# EAGLE board Keyboard (EAGLE 6.3), part 1 of 2
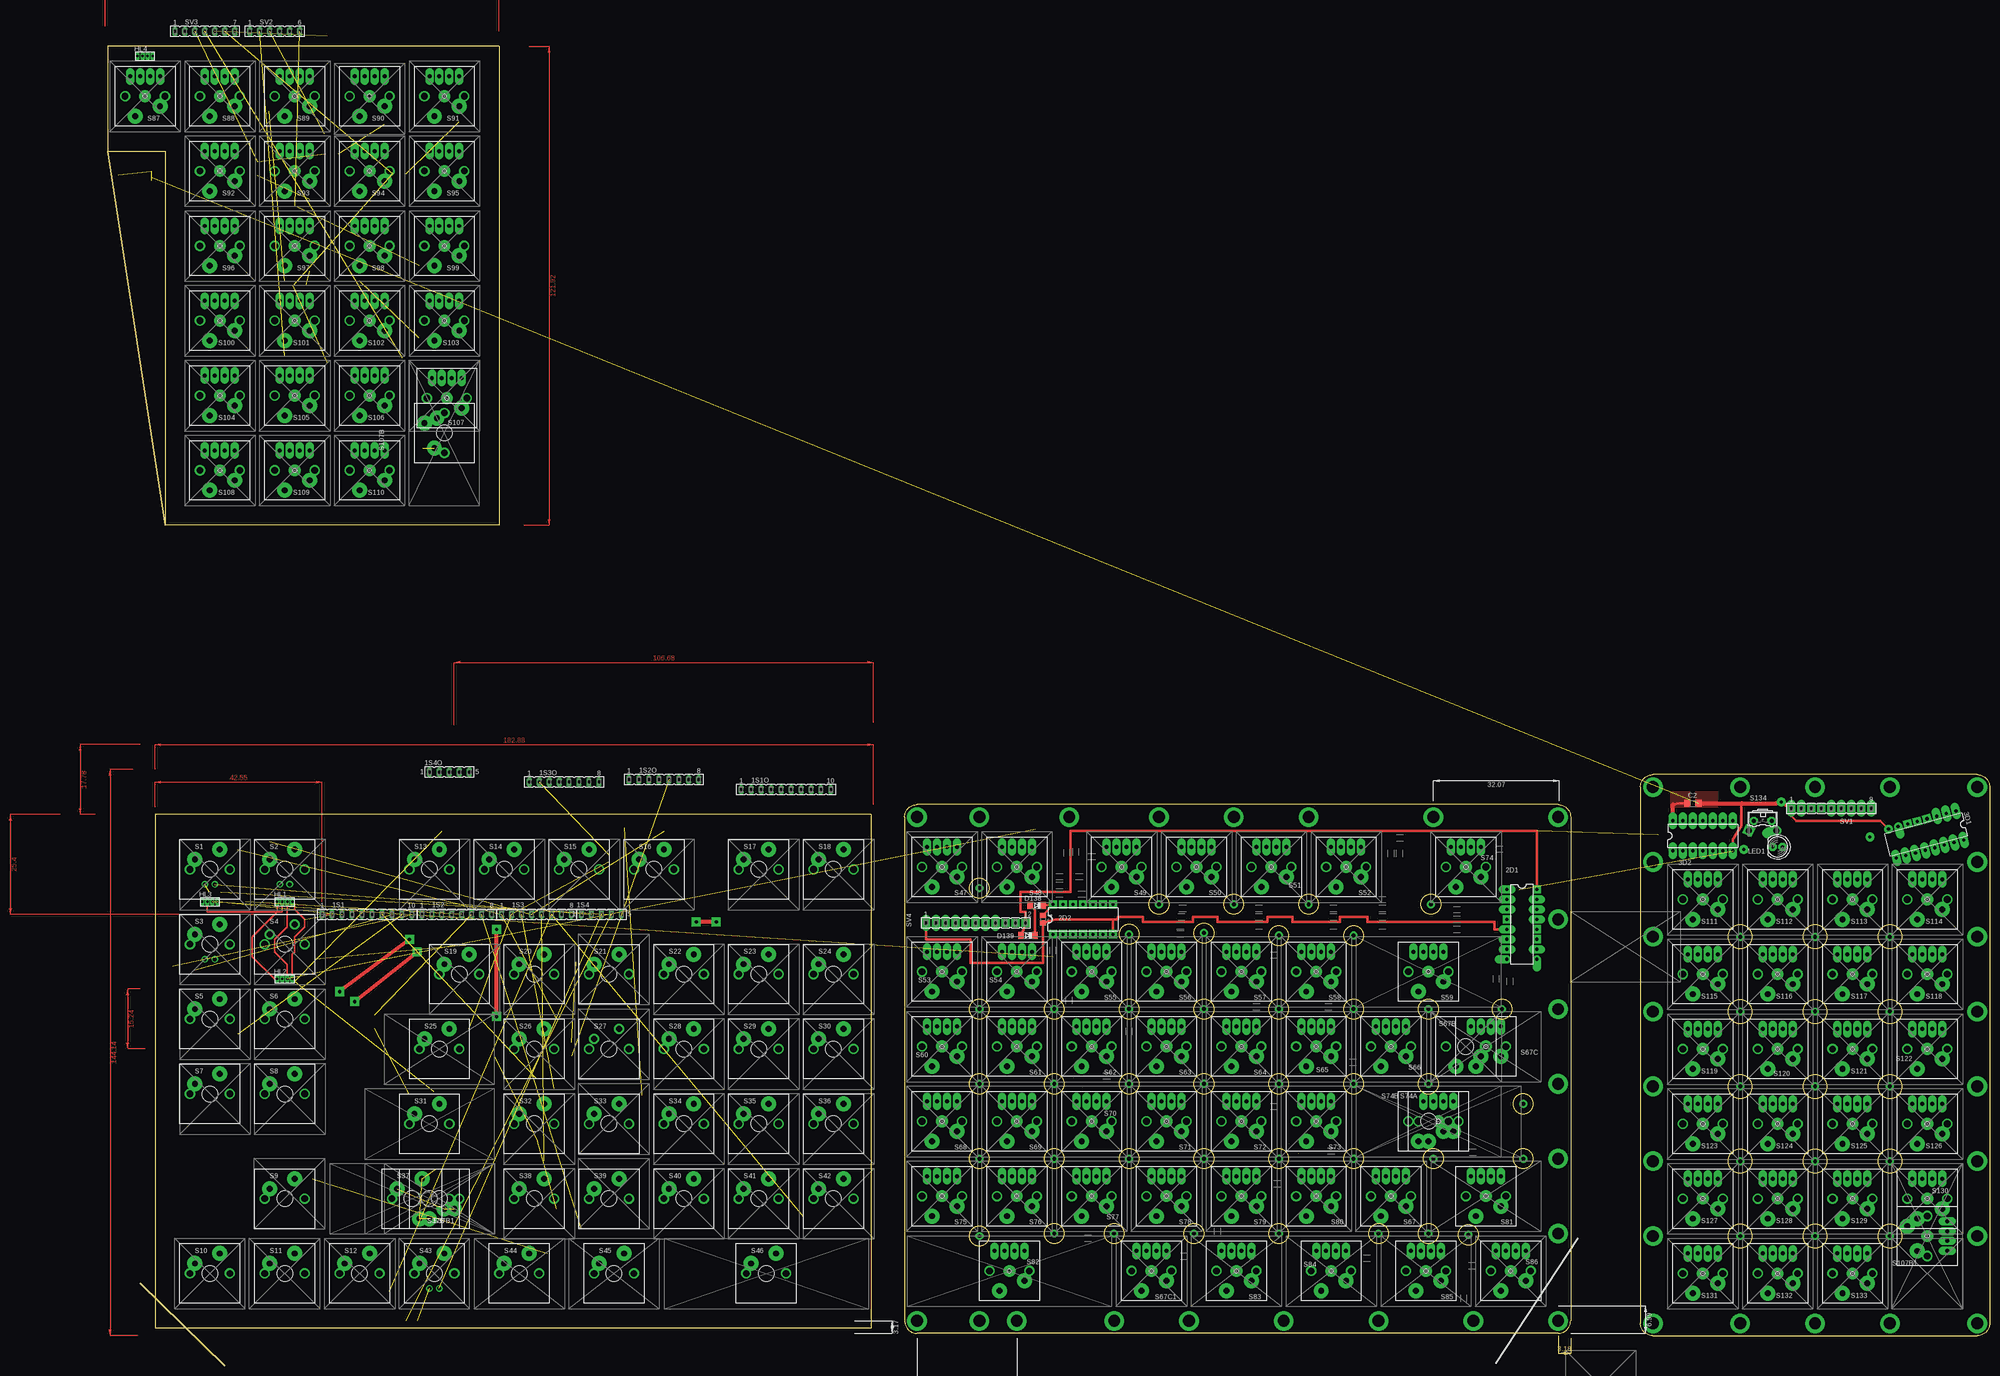
[diagram p4: board, top side]
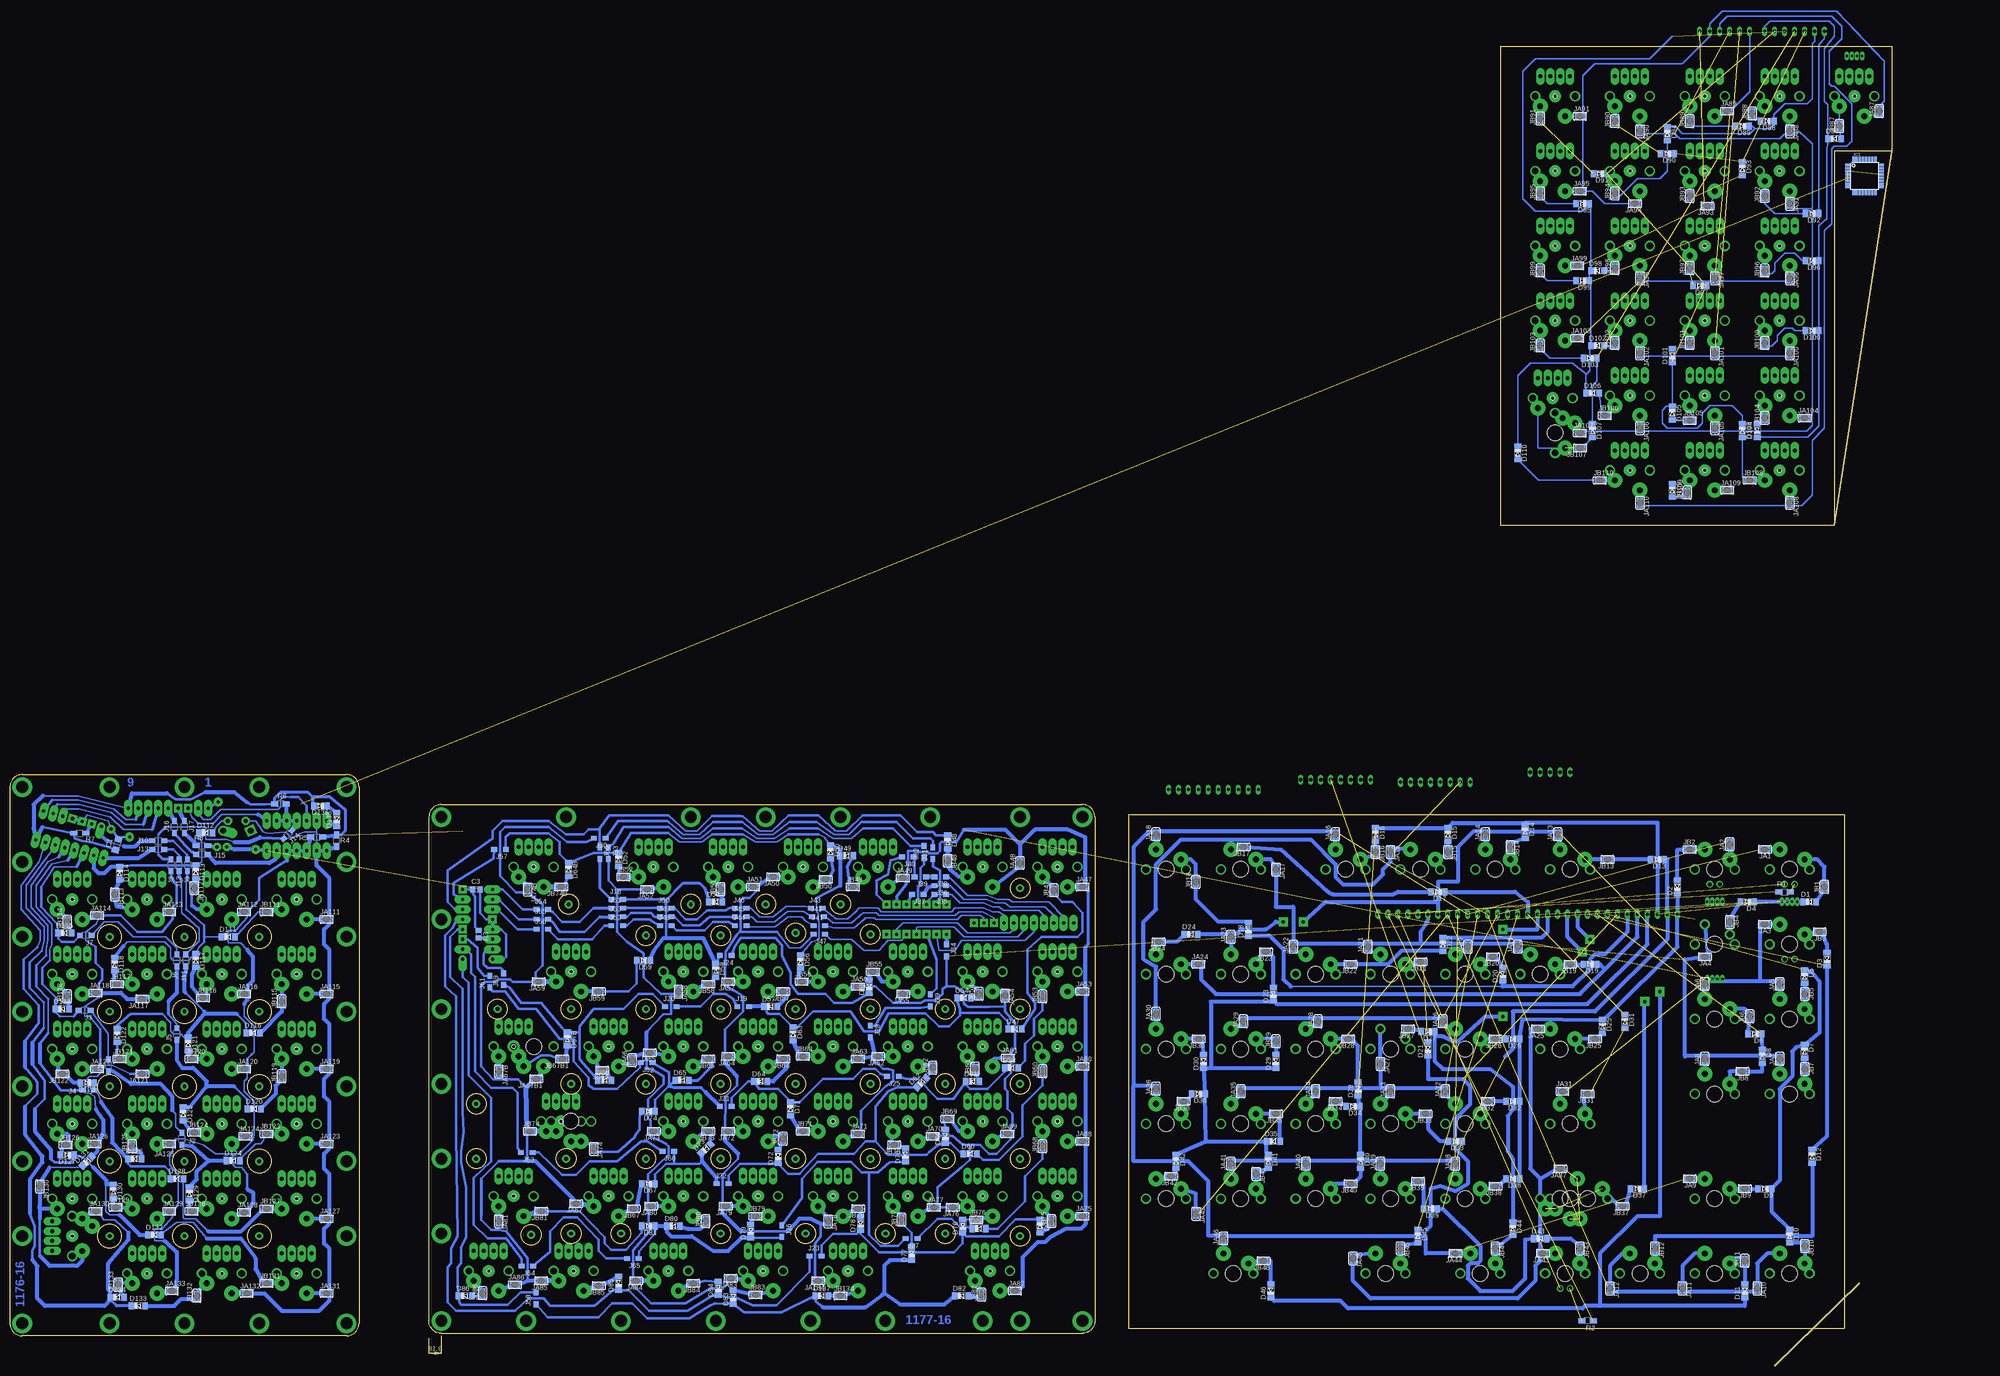
[diagram p5: board, bottom side, seen from below]

Size 479.11 x 335.91 mm. Coordinates in mm from the lower left corner, seen from the top.
Outline: 0,309.25 0,335.91 99.69,335.91 99.69,214 14.61,214
Outline: 0,309.25 14.61,309.25 14.61,214
Outline: 0,309.25 14.61,214
Outline: 8.26,20.96 29.84,0
Outline: 194.31,140.33 194.31,9.53 12.06,9.53 12.06,140.33 194.31,140.33
Outline: 475.93,150.5 393.38,150.5 arc90 390.21,147.32 390.21,10.79 arc90 393.38,7.62 475.93,7.62 arc90 479.11,10.79 479.11,147.32 arc90 475.93,150.5
Outline: 202.88,139.7 202.88,11.43 arc90 206.06,8.26 369.25,8.26 arc90 372.43,11.43 372.43,139.7 arc90 369.25,142.88 206.06,142.88 arc90 202.88,139.7
Outline: circle at 453.71,33.02 radius 3
Outline: circle at 453.71,109.22 radius 3
Outline: circle at 415.61,52.07 radius 3
Outline: circle at 434.66,52.07 radius 3
Outline: circle at 434.66,33.02 radius 3
Outline: circle at 415.61,33.02 radius 3
Outline: circle at 415.61,71.12 radius 3
Outline: circle at 415.61,90.17 radius 3
Outline: circle at 453.71,52.07 radius 3
Outline: circle at 453.71,71.12 radius 3
Outline: circle at 453.71,90.17 radius 3
Outline: circle at 434.66,90.17 radius 3
Outline: circle at 434.66,109.22 radius 3
Outline: circle at 415.61,109.22 radius 3
Outline: circle at 434.66,71.12 radius 3
Outline: circle at 221.93,90.81 radius 2.5
Outline: circle at 240.98,90.81 radius 2.5
Outline: circle at 260.03,90.81 radius 2.5
Outline: circle at 221.93,71.76 radius 2.5
Outline: circle at 240.98,71.76 radius 2.5
Copper layers (1*16): Top 0.035mm / dielectric 1.5mm / Bottom 0.035mm
Design rules "default": minimum track width 10mil, minimum drill 24mil, track to track 8mil, track to pad 8mil, pad to pad 8mil, via to via 8mil, smd to smd 8mil, copper to edge 40mil, drill to drill 8mil, minimum pad ring 10mil, minimum via ring 8mil, stop-mask expansion 4mil, vias tented up to drill 0mil, thermal gap 10mil

## Footprints (pad centres in the part's own frame; a part is rotated, then mirrored left to right if it is on the bottom)
FE10 = drill 0.813 long: 1 -11.43,0; 2 -8.89,0; 3 -6.35,0; 4 -3.81,0; 5 -1.27,0; 6 1.27,0; 7 3.81,0; 8 6.35,0; 9 8.89,0; 10 11.43,0
FE08 = drill 0.813 long: 1 -8.89,0; 2 -6.35,0; 3 -3.81,0; 4 -1.27,0; 5 1.27,0; 6 3.81,0; 7 6.35,0; 8 8.89,0
FE05-1 = drill 0.813 long: 1 -5.08,0; 2 -2.54,0; 3 0,0; 4 2.54,0; 5 5.08,0
DIL16 = drill 0.813 pad 2.1 long: 1 -8.89,-3.81; 2 -6.35,-3.81; 3 -3.81,-3.81; 5 1.27,-3.81; 6 3.81,-3.81; 7 6.35,-3.81; 10 6.35,3.81; 13 -1.27,3.81; 14 -3.81,3.81; 15 -6.35,3.81 | drill 0.813 pad 2.1 square: 4 -1.27,-3.81; 11 3.81,3.81; 12 1.27,3.81; 16 -8.89,3.81 | drill 0.813 pad 2.1 offset: 8 8.89,-3.81; 9 8.89,3.81
DIL14 = drill 0.813 pad 2.1 square: 1 -7.62,-3.81; 2 -5.08,-3.81; 3 -2.54,-3.81; 4 0,-3.81; 5 2.54,-3.81; 6 5.08,-3.81; 7 7.62,-3.81; 8 7.62,3.81; 9 5.08,3.81; 10 2.54,3.81; 11 0,3.81; 12 -2.54,3.81; 13 -5.08,3.81; 14 -7.62,3.81
DIL16' = drill 0.813 pad 2.1 long: 1 -8.89,-3.81; 2 -6.35,-3.81; 3 -3.81,-3.81; 9 8.89,3.81; 10 6.35,3.81; 11 3.81,3.81; 12 1.27,3.81; 13 -1.27,3.81; 14 -3.81,3.81; 15 -6.35,3.81; 16 -8.89,3.81 | drill 0.813 pad 2.1 square: 4 -1.27,-3.81; 5 1.27,-3.81; 6 3.81,-3.81 | drill 0.813 pad 2.1 offset: 7 6.35,-3.81 | drill 0.813 pad 2.1: 8 8.89,-3.81
DIL14' = drill 0.813 pad 2.1 long: 1 -7.62,-3.81; 2 -5.08,-3.81; 3 -2.54,-3.81; 4 0,-3.81; 5 2.54,-3.81; 6 5.08,-3.81; 7 7.62,-3.81; 8 7.62,3.81; 9 5.08,3.81; 10 2.54,3.81; 11 0,3.81; 12 -2.54,3.81; 13 -5.08,3.81; 14 -7.62,3.81
C1206 = smd 1.6 x 1.8: 1 -1.4,0; 2 1.4,0
C0805 = smd 1.3 x 1.5: 1 -0.95,0; 2 0.95,0
SOD80C = smd 1.4 x 1.8 bottom: A -1.7,0; C 1.7,0
RGB2X5 = drill 0.6 long: 1 -1.95,-0.585; 2 -0.65,-0.585; 3 0.65,-0.585; 4 1.95,-0.585
TQFP32-08 = smd 1.27 x 0.559: 1 -4.293,2.8; 2 -4.293,2; 3 -4.293,1.2; 4 -4.293,0.4; 5 -4.293,-0.4; 6 -4.293,-1.2; 7 -4.293,-2; 8 -4.293,-2.8; 17 4.293,-2.8; 18 4.293,-2; 19 4.293,-1.2; 20 4.293,-0.4; 21 4.293,0.4; 22 4.293,1.2; 23 4.293,2; 24 4.293,2.8 | smd 0.559 x 1.27: 9 -2.8,-4.293; 10 -2,-4.293; 11 -1.2,-4.293; 12 -0.4,-4.293; 13 0.4,-4.293; 14 1.2,-4.293; 15 2,-4.293; 16 2.8,-4.293; 25 2.8,4.293; 26 2,4.293; 27 1.2,4.293; 28 0.4,4.293; 29 -0.4,4.293; 30 -1.2,4.293; 31 -2,4.293; 32 -2.8,4.293
R1206W = smd 1.5 x 1.2: 1 -1.499,0; 2 1.499,0
R1206W' = smd 1.5 x 1.2 bottom: 1 1.499,0; 2 -1.499,0
SJ = smd 1.168 x 1.6: 1 -0.762,0; 2 0.762,0
SJ' = smd 1.168 x 1.6 bottom: 1 0.762,0; 2 -0.762,0
LED5MM = drill 0.813 pad 2.1 octagon: A -1.27,0; K 1.27,0
R1206W'' = smd 1.8 x 1.2: 1 -1.499,0; 2 1.499,0
R0805 = smd 1.3 x 1.5: 1 -0.95,0; 2 0.95,0
CHERRY-MX-LED = drill 1.016 pad 1.676: LED1 -1.27,-3.81; LED2 1.27,-3.81 | drill 0.8 pad 1.27: P$1 0,0 | drill 1.714 pad 1.93: P$3 -5.08,0; P$4 5.08,0 | drill 1.5 pad 3.81: SW1 -3.81,2.54; SW2 2.54,5.08 | hole 4: 0,0
CHERRY-MX@1 = drill 1.714 pad 1.93: P$3 -5.08,0; P$4 5.08,0 | drill 1.5 pad 2.54: SW1 -3.81,2.54; SW2 2.54,5.08 | hole 4: 0,0
CHERRY-MX = drill 0.8: P$1 0,0 | drill 1.714 pad 1.93: P$3 -5.08,0; P$4 5.08,0 | drill 1.5 pad 3.81: SW1 -3.81,2.54; SW2 2.54,5.08 | hole 4: 0,0
CHERRY-MX-4P = drill 1.016 pad 2.184 long: D1 -3.81,-5.08; D2 3.81,-5.08; LED1 -1.27,-5.08; LED2 1.27,-5.08 | drill 1 pad 3: P$1 0,0 | drill 1.714 pad 1.93: P$3 -5.08,0; P$4 5.08,0 | drill 1.5 pad 3.81: SW1 -3.81,2.54; SW2 2.54,5.08 | hole 1: 0,0
B3F-31XX = drill 1.016 pad 2.1 octagon: 1 -2.261,-1.245; 2 2.261,-1.245 | drill 1.499 pad 2.5 offset: 3 -3.505,1.245 | drill 1.499 pad 2.5 square: 4 3.505,1.245
FE09 = drill 0.813 pad 2.1 long: 1 -10.16,0; 2 -7.62,0; 5 0,0; 6 2.54,0; 7 5.08,0; 8 7.62,0; 9 10.16,0 | drill 0.813 pad 2.1 square: 3 -5.08,0; 4 -2.54,0
FE06 = drill 0.813 long: 1 -6.35,0; 2 -3.81,0; 3 -1.27,0; 4 1.27,0; 5 3.81,0; 6 6.35,0
FE07 = drill 0.813 long: 1 -7.62,0; 2 -5.08,0; 3 -2.54,0; 4 0,0; 5 2.54,0; 6 5.08,0; 7 7.62,0
FE12 = drill 0.813 pad 2.1 long: 1 -13.97,0; 2 -11.43,0; 3 -8.89,0; 4 -6.35,0; 5 -3.81,0; 6 -1.27,0; 7 1.27,0; 8 3.81,0 | drill 0.813 pad 2.1 square: 9 6.35,0; 10 8.89,0; 11 11.43,0

## Placement (x,y rotation side)
1S1  [FE10]  66.04,114.94 0 top
1S1O  [FE10]  172.72,146.69 0 top
1S2  [FE08]  88.9,114.94 0 top
1S2O  [FE08]  141.61,149.22 0 top
1S3  [FE08]  109.22,114.94 0 top
1S3O  [FE08]  116.2,148.59 0 top
1S4  [FE05-1]  125.73,114.94 0 top
1S4O  [FE05-1]  86.99,151.13 0 top
2D1  74HC138N  [DIL16]  360.05,112.4 270 top
2D2  74ALS04N  [DIL14]  248.28,113.67 0 top
3D1  74HC138N  [DIL16']  462.92,135.25 195 top
3D2  К155ЛА4  [DIL14']  406.08,134.94 0 top
C1  [C1206]  451.8,132.72 75 bottom
C2  [C1206]  403.54,143.19 0 top
C3  100n  [C0805]  360.36,121.29 0 bottom
C4  100n  [C0805]  238.12,113.67 270 top
D1  LL4148  [SOD80C]  20.95,118.11 0 top
D2  LL4148  [SOD80C]  54.61,121.92 270 top
D3  LL4148  [SOD80C]  16.51,103.51 270 top
D4  LL4148  [SOD80C]  36.83,118.11 180 top
D5  LL4148  [SOD80C]  22.22,99.06 90 top
D6  LL4148  [SOD80C]  34.93,84.45 180 top
D7  LL4148  [SOD80C]  22.22,80.01 90 top
D8  LL4148  [SOD80C]  33.02,78.74 90 top
D9  LL4148  [SOD80C]  32.39,45.09 180 top
D10  LL4148  [SOD80C]  26.04,33.02 90 top
D11  LL4148  [SOD80C]  37.47,19.05 270 top
D12  LL4148  [SOD80C]  20.32,53.34 90 top
D13  LL4148  [SOD80C]  59.69,128.91 180 top
D14  LL4148  [SOD80C]  93.34,136.05 90 top
D15  LL4148  [SOD80C]  113.03,135.25 90 top
D16  LL4148  [SOD80C]  131.45,135.25 90 top
D17  LL4148  [SOD80C]  115.57,120.65 180 top
D18  LL4148  [SOD80C]  163.83,111.12 270 top
D19  LL4148  [SOD80C]  76.83,102.23 180 top
D20  LL4148  [SOD80C]  99.06,99.7 270 top
D21  LL4148  [SOD80C]  118.11,80.65 270 top
D22  LL4148  [SOD80C]  114.3,107.32 90 top
D23  LL4148  [SOD80C]  157.48,94.62 270 top
D24  LL4148  [SOD80C]  178.44,109.86 0 top
D25  LL4148  [SOD80C]  73.66,86.36 90 top
D26  LL4148  [SOD80C]  96.52,83.19 180 top
D27  LL4148  [SOD80C]  118.11,85.09 180 top
D28  LL4148  [SOD80C]  135.89,70.48 270 top
D29  LL4148  [SOD80C]  156.84,77.47 270 top
D30  LL4148  [SOD80C]  175.26,77.47 270 top
D31  LL4148  [SOD80C]  67.94,87.63 90 top
D32  LL4148  [SOD80C]  96.52,67.31 180 top
D33  LL4148  [SOD80C]  111.12,57.15 180 top
D34  LL4148  [SOD80C]  137.16,66.04 180 top
D35  LL4148  [SOD80C]  157.48,57.15 0 top
D36  LL4148  [SOD80C]  176.53,69.22 180 top
D37  LL4148  [SOD80C]  64.77,45.09 180 top
D38  LL4148  [SOD80C]  96.52,47.62 180 top
D39  LL4148  [SOD80C]  117.47,40 180 top
D40  LL4148  [SOD80C]  135.25,52.07 90 top
D41  LL4148  [SOD80C]  158.75,52.07 90 top
D42  LL4148  [SOD80C]  182.25,52.07 90 top
D43  LL4148  [SOD80C]  89.53,32.38 0 top
D44  LL4148  [SOD80C]  96.52,34.92 90 top
D45  LL4148  [SOD80C]  120.65,33.02 90 top
D46  LL4148  [SOD80C]  158.12,19.05 270 top
D47  LL4148  [SOD80C]  223.2,85.73 0 top
D48  LL4148  [SOD80C]  240.35,133.35 90 top
D49  LL4148  [SOD80C]  266.06,129.86 0 top
D50  LL4148  [SOD80C]  270.19,130.81 90 top
D51  LL4148  [SOD80C]  299.4,118.11 0 top
D52  LL4148  [SOD80C]  324.17,128.91 90 top
D53  LL4148  [SOD80C]  224.16,75.88 0 top
D54  LL4148  [SOD80C]  236.22,93.66 0 top
D55  LL4148  [SOD80C]  260.35,96.52 270 top
D56  LL4148  [SOD80C]  277.81,102.87 90 top
D57  LL4148  [SOD80C]  285.43,91.44 0 top
D58  LL4148  [SOD80C]  299.4,100.65 90 top
D59  LL4148  [SOD80C]  317.82,103.19 180 top
D60  LL4148  [SOD80C]  234.63,53.98 0 top
D61  LL4148  [SOD80C]  234,72.39 0 top
D62  LL4148  [SOD80C]  247.02,72.07 315 top
D63  LL4148  [SOD80C]  279.72,84.45 90 top
D64  LL4148  [SOD80C]  287.97,72.39 0 top
D64B  LL4148  [SOD80C]  336.87,126.37 90 top
D65  LL4148  [SOD80C]  307.98,72.71 0 top
D66  LL4148  [SOD80C]  327.66,72.71 0 top
D67  LL4148  [SOD80C]  316.55,46.35 180 top
D67B  LL4148  [SOD80C]  337.19,83.19 90 top
D68  LL4148  [SOD80C]  232.41,34.92 0 top
D69  LL4148  [SOD80C]  240.98,58.42 270 top
D70  LL4148  [SOD80C]  251.14,53.66 270 top
D71  LL4148  [SOD80C]  280.35,65.41 90 top
D72  LL4148  [SOD80C]  283.53,53.34 270 top
D73  LL4148  [SOD80C]  301.94,55.24 315 top
D74  LL4148  [SOD80C]  316.55,64.77 180 top
D75  LL4148  [SOD80C]  216.85,35.56 90 top
D76  LL4148  [SOD80C]  236.54,35.56 270 top
D77  LL4148  [SOD80C]  249.56,28.58 270 top
D78  LL4148  [SOD80C]  262.57,36.2 270 top
D79  LL4148  [SOD80C]  290.51,34.29 270 top
D80  LL4148  [SOD80C]  310.2,35.56 0 top
D81  LL4148  [SOD80C]  316.55,35.56 180 top
D82  LL4148  [SOD80C]  236.86,17.78 0 top
D83  LL4148  [SOD80C]  294.96,17.46 270 top
D84  LL4148  [SOD80C]  298.77,19.69 270 top
D85  LL4148  [SOD80C]  324.17,20.96 270 top
D86  LL4148  [SOD80C]  363.22,17.78 0 top
D87  LL4148  [SOD80C]  14.61,312.42 0 top
D88  LL4148  [SOD80C]  31.75,316.87 180 top
D89  LL4148  [SOD80C]  38.1,315.59 180 top
D90  LL4148  [SOD80C]  57.15,308.61 180 top
D91  LL4148  [SOD80C]  74.3,303.53 180 top
D92  LL4148  [SOD80C]  20.32,293.37 180 top
D93  LL4148  [SOD80C]  38.1,304.8 90 top
D94  LL4148  [SOD80C]  57.15,313.69 90 top
D95  LL4148  [SOD80C]  78.74,295.91 180 top
D96  LL4148  [SOD80C]  20.32,281.31 180 top
D97  LL4148  [SOD80C]  48.9,274.95 180 top
D98  LL4148  [SOD80C]  74.93,278.76 0 top
D99  LL4148  [SOD80C]  78.74,276.22 180 top
D100  LL4148  [SOD80C]  20.32,263.52 180 top
D101  LL4148  [SOD80C]  55.88,257.18 270 top
D102  LL4148  [SOD80C]  74.93,259.71 0 top
D103  LL4148  [SOD80C]  76.83,256.54 180 top
D104  LL4148  [SOD80C]  34.29,238.12 270 top
D105  LL4148  [SOD80C]  55.88,242.57 90 top
D106  LL4148  [SOD80C]  76.2,247.65 0 top
D107  LL4148  [SOD80C]  76.2,238.12 90 top
D108  LL4148  [SOD80C]  38.1,238.12 90 top
D109  LL4148  [SOD80C]  55.88,222.88 90 top
D110  LL4148  [SOD80C]  95.25,232.41 90 top
D111  LL4148  [SOD80C]  423.55,109.22 0 top
D112  LL4148  [SOD80C]  429.27,135.7 0 top
D113  LL4148  [SOD80C]  431.8,125.73 90 top
D114  LL4148  [SOD80C]  451.17,125.41 90 top
D115  LL4148  [SOD80C]  465.14,110.17 0 top
D116  LL4148  [SOD80C]  417.19,84.77 0 top
D117  LL4148  [SOD80C]  431.8,103.19 90 top
D118  LL4148  [SOD80C]  452.44,102.23 90 top
D119  LL4148  [SOD80C]  465.77,90.81 0 top
D120  LL4148  [SOD80C]  416.88,65.41 0 top
D121  LL4148  [SOD80C]  433.7,81.92 90 top
D122  LL4148  [SOD80C]  451.8,84.14 90 top
D123  LL4148  [SOD80C]  459.42,72.07 180 top
D124  LL4148  [SOD80C]  422.28,52.23 0 top
D125  LL4148  [SOD80C]  434.98,64.14 90 top
D126  LL4148  [SOD80C]  447.36,52.7 0 top
D127  LL4148  [SOD80C]  464.5,53.66 180 top
D128  LL4148  [SOD80C]  436.56,47.62 0 top
D129  LL4148  [SOD80C]  433.39,43.81 90 top
D130  LL4148  [SOD80C]  452.75,44.45 90 top
D131  LL4148  [SOD80C]  459.42,52.07 315 top
D132  LL4148  [SOD80C]  442.28,33.34 0 top
D133  LL4148  [SOD80C]  446.41,15.24 0 top
D134  LL4148  [SOD80C]  451.8,17.46 0 top
D135  LL4148  [SOD80C]  395.92,139.06 270 top
D136  LL4148  [SOD80C]  400.05,142.56 180 top
D137  LL4148  [SOD80C]  272.42,17.78 0 top
D138  LL4148  [SOD80C]  236.54,117.16 180 bottom
D139  LL4148  [SOD80C]  234.31,109.54 180 bottom
HL1  [RGB2X5]  45.09,118.75 0 top
HL2  [RGB2X5]  45.09,99.06 0 top
HL3  [RGB2X5]  26.04,118.75 0 top
HL4  [RGB2X5]  9.53,334.01 0 top
IC1  MEGA8-AI  [TQFP32-08]  6.99,302.89 0 bottom
J1  J  [R1206W]  454.03,76.52 90 bottom
J2  J  [R1206W]  435.29,57.78 90 bottom
J3  J  [R1206W]  460.06,90.49 180 bottom
J4  J  [R1206W]  459.11,70.17 180 bottom
J5  J  [R1206W]  436.56,84.45 90 bottom
J6  J  [R1206W]  436.56,103.19 90 bottom
J7  J  [R1206W]  459.74,109.54 180 bottom
J8  J  [R1206W]  438.09,127.44 270 bottom
J9  J  [R1206W]  433.9,127.44 270 bottom
J10  J  [R1206W]  441.32,133.67 0 bottom
J11  J  [R1206W]  434.34,103.19 270 bottom
J12  J  [R1206W]  435.99,127.44 90 bottom
J13  J  [R1206W]  441.32,131.44 180 bottom
J14  J  [R1206W]  408.31,135.25 225 bottom
J15  J  [R1206W]  430.21,130.17 180 bottom
J16  J  [R1206W]  437.2,137.16 90 bottom
J17  J  [R1206W]  434.66,137.16 90 bottom
J18  [R1206W']  324.49,118.75 0 top
J19  [R1206W']  292.42,91.44 0 top
J20  [R1206W']  310.83,91.44 0 top
J21  [R1206W']  296.86,66.04 0 top
J22  [R1206W']  297.66,46.35 0 top
J23  [R1206W']  274,27.94 0 top
J24  [R1206W']  296.86,104.46 180 top
J25  [R1206W']  254.32,73.66 180 top
J26  [R1206W']  282.57,34.29 90 top
J27  [R1206W']  249.56,32.38 180 top
J28  [R1206W']  260.03,85.09 90 top
J29  [R1206W']  244.79,93.03 90 top
J30  [R1206W']  328.93,134.3 180 top
J31  [R1206W']  244.16,130.49 270 top
J32  [R1206W']  246.38,130.81 270 top
J33  [R1206W']  326.71,130.49 90 top
J34  [R1206W']  240.67,105.73 90 top
J35  [R1206W']  242.25,120.02 180 top
J36  [R1206W']  242.25,122.24 180 top
J37  [R1206W']  247.97,120.02 180 top
J38  [R1206W']  242.25,124.46 180 top
J39  [R1206W']  247.33,124.46 180 top
J40  [R1206W']  250.51,129.54 180 top
J41  [R1206W']  273.05,112.08 0 top
J42  [R1206W']  273.37,114.3 0 top
J43  [R1206W']  273.69,116.52 0 top
J44  [R1206W']  293.05,112.08 0 top
J45  [R1206W']  293.05,114.3 0 top
J46  [R1206W']  293.05,116.52 0 top
J47  [R1206W']  273.05,109.86 180 top
J48  [R1206W']  312.1,112.08 0 top
J49  [R1206W']  312.1,114.3 0 top
J50  [R1206W']  312.1,116.52 0 top
J51  [R1206W']  324.49,116.52 0 top
J52  [R1206W']  324.49,112.08 0 top
J53  [R1206W']  324.49,114.3 0 top
J54  [R1206W']  343.54,116.2 0 top
J55  [R1206W']  343.54,113.67 0 top
J56  [R1206W']  343.54,111.12 0 top
J57  [R1206W']  354.33,131.44 180 top
J58  [R1206W']  345.12,17.15 270 top
J59  [R1206W']  353.38,98.43 270 top
J60  [R1206W']  311.47,54.61 180 top
J61  [R1206W']  356.87,97.79 270 top
J62  [R1206W']  317.02,77.15 180 top
J63  [R1206W']  347.5,54.29 180 top
J64  [R1206W']  347.35,25.4 180 top
J65  [R1206W']  320.52,27.31 180 top
J66  [R1206W']  328.93,130.49 90 top
JA1  [SJ]  32.39,131.44 180 bottom
JA2  [SJ]  41.27,132.72 90 bottom
JA3  [SJ]  32.39,112.4 180 bottom
JA4  [SJ]  47.62,104.14 180 bottom
JA5  [SJ]  28.57,97.16 90 bottom
JA6  [SJ]  47.62,97.16 90 bottom
JA7  [SJ]  28.57,78.11 90 bottom
JA8  [SJ]  47.62,78.11 90 bottom
JA9  [SJ]  51.44,47.62 180 bottom
JA10  [SJ]  34.29,19.69 270 bottom
JA11  [SJ]  53.34,19.69 270 bottom
JA12  [SJ]  71.75,19.69 270 bottom
JA13  [SJ']  85.09,135.25 270 top
JA14  [SJ']  103.5,135.25 270 top
JA15  [SJ']  127.64,130.81 90 top
JA16  [SJ']  141.61,135.25 270 top
JA17  [SJ']  156.84,126.37 90 top
JA18  [SJ']  187.33,135.25 270 top
JA19  [SJ']  95.25,106.68 270 top
JA20  [SJ']  107.95,106.68 270 top
JA21  [SJ']  133.35,106.68 270 top
JA22  [SJ']  152.4,106.68 270 top
JA23  [SJ']  168.28,109.22 270 top
JA24  [SJ']  176.53,102.23 0 top
JA25  [SJ']  90.17,85.73 180 top
JA26  [SJ']  114.3,87.63 270 top
JA27  [SJ']  130.18,76.84 90 top
JA28  [SJ']  146.05,87.63 270 top
JA29  [SJ']  165.1,87.63 270 top
JA30  [SJ']  187.33,89.54 270 top
JA31  [SJ']  83.82,69.85 0 top
JA32  [SJ']  113.66,69.85 270 top
JA33  [SJ']  127.64,69.85 270 top
JA34  [SJ']  146.69,69.85 270 top
JA35  [SJ']  165.74,69.85 270 top
JA36  [SJ']  187.33,70.48 270 top
JA37  [SJ']  84.45,50.16 180 top
JA38  [SJ']  111.12,51.43 270 top
JA39  [SJ']  130.18,51.43 270 top
JA40  [SJ']  149.23,51.43 270 top
JA41  [SJ']  168.28,51.43 270 top
JA42  [SJ']  177.17,38.73 90 top
JA43  [SJ']  88.9,28.58 180 top
JA44  [SJ']  111.12,28.58 180 top
JA45  [SJ']  137.16,27.31 90 top
JA46  [SJ']  170.18,32.38 270 top
JA47  [SJ']  206.06,121.92 0 top
JA48  [SJ']  221.93,127.95 270 top
JA49  [SJ']  251.78,124.14 0 top
JA50  [SJ']  284.8,124.46 180 top
JA51  [SJ']  289.88,121.92 0 top
JA52  [SJ']  316.87,121.29 180 top
JA53  [SJ']  206.06,95.25 0 top
JA54  [SJ']  225.74,94.3 90 top
JA55  [SJ']  251.78,94.62 180 top
JA56  [SJ']  263.21,96.52 0 top
JA57  [SJ']  296.23,97.79 180 top
JA58  [SJ']  308.93,95.25 90 top
JA59  [SJ']  344.49,97.79 180 top
JA60  [SJ']  206.06,76.2 0 top
JA61  [SJ']  224.95,78.42 0 top
JA62  [SJ']  258.13,78.74 180 top
JA63  [SJ']  263.21,78.11 0 top
JA64  [SJ']  296.23,78.74 180 top
JA65  [SJ']  316.23,79.69 180 top
JA66  [SJ']  320.68,77.79 270 top
JA67  [SJ']  334.96,41.27 180 top
JA67B  [SJ']  354.65,74.93 90 top
JA67B1  [SJ']  345.12,73.03 180 top
JA68  [SJ']  206.06,57.15 0 top
JA69  [SJ']  225.11,59.05 0 top
JA70  [SJ']  244.16,58.42 0 top
JA71  [SJ']  263.21,59.05 0 top
JA72  [SJ']  296.23,59.69 180 top
JA73  [SJ']  315.28,59.69 180 top
JA74  [SJ']  330.52,55.24 90 top
JA74B  [SJ']  347.35,121.29 90 top
JA75  [SJ']  206.06,38.1 0 top
JA76  [SJ']  239.08,40.32 180 top
JA77  [SJ']  243.84,40.32 0 top
JA78  [SJ']  270.83,36.83 90 top
JA79  [SJ']  296.86,40.64 180 top
JA80  [SJ']  315.91,40.64 180 top
JA81  [SJ']  354.65,36.83 90 top
JA82  [SJ']  223.2,19.05 0 top
JA83  [SJ']  295.59,22.23 180 top
JA84  [SJ']  319.72,21.59 180 top
JA85  [SJ']  343.85,21.59 180 top
JA86  [SJ']  350.52,20.64 0 top
JA87  [SJ']  3.17,319.4 270 top
JA88  [SJ']  26.04,314.32 90 top
JA89  [SJ']  41.91,319.4 0 top
JA90  [SJ']  64.13,314.32 90 top
JA91  [SJ']  79.38,318.13 0 top
JA92  [SJ']  26.04,295.91 90 top
JA93  [SJ']  46.99,295.27 180 top
JA94  [SJ']  65.41,295.91 180 top
JA95  [SJ']  79.38,299.08 0 top
JA96  [SJ']  26.04,276.86 90 top
JA97  [SJ']  45.09,276.86 90 top
JA98  [SJ']  64.13,276.86 90 top
JA99  [SJ']  80.01,280.03 0 top
JA100  [SJ']  26.04,257.81 90 top
JA101  [SJ']  45.09,257.81 90 top
JA102  [SJ']  64.13,257.81 90 top
JA103  [SJ']  80.01,261.62 0 top
JA104  [SJ']  22.22,241.3 0 top
JA105  [SJ']  45.09,238.76 90 top
JA106  [SJ']  64.13,238.76 90 top
JA107  [SJ']  79.38,237.49 0 top
JA108  [SJ']  26.04,219.71 90 top
JA109  [SJ']  41.91,222.88 0 top
JA110  [SJ']  64.13,219.71 90 top
JA111  [SJ']  398.46,113.67 0 top
JA112  [SJ']  419.42,115.57 0 top
JA113  [SJ']  438.47,115.57 0 top
JA114  [SJ']  456.88,114.62 0 top
JA115  [SJ']  398.46,94.62 0 top
JA116  [SJ']  419.42,94.62 0 top
JA117  [SJ']  445.45,93.34 180 top
JA118  [SJ']  457.2,94.93 0 top
JA119  [SJ']  398.46,75.57 0 top
JA120  [SJ']  419.42,75.57 0 top
JA121  [SJ']  445.45,74.3 180 top
JA122  [SJ']  456.88,75.57 0 top
JA123  [SJ']  398.46,56.52 0 top
JA124  [SJ']  419.1,58.42 0 top
JA125  [SJ']  438.47,56.52 0 top
JA126  [SJ']  457.52,56.52 0 top
JA127  [SJ']  398.46,37.46 0 top
JA128  [SJ']  419.42,39.05 0 top
JA129  [SJ']  438.47,39.37 0 top
JA130  [SJ']  457.2,39.37 0 top
JA131  [SJ']  398.46,18.42 0 top
JA132  [SJ']  418.78,18.42 0 top
JA133  [SJ']  437.83,19.05 0 top
JA134  [SJ']  273.37,21.59 180 top
JB1  [SJ']  17.14,121.92 270 top
JB2  [SJ]  51.44,131.44 0 bottom
JB3  [SJ']  18.41,110.49 180 top
JB4  [SJ]  41.27,113.03 270 bottom
JB5  [SJ]  22.22,94.62 270 bottom
JB6  [SJ]  36.2,88.9 90 bottom
JB7  [SJ]  22.22,75.57 270 bottom
JB8  [SJ]  38.1,74.93 180 bottom
JB9  [SJ]  37.47,45.09 180 bottom
JB10  [SJ]  22.22,30.48 270 bottom
JB11  [SJ]  37.47,26.67 90 bottom
JB12  [SJ]  60.33,29.85 270 bottom
JB13  [SJ]  72.39,128.91 180 bottom
JB14  [SJ]  97.16,132.08 270 bottom
JB15  [SJ]  113.03,130.81 270 bottom
JB16  [SJ]  131.45,130.81 270 bottom
JB17  [SJ]  165.1,132.08 180 bottom
JB18  [SJ']  177.17,123.19 270 top
JB19  [SJ']  81.91,102.23 180 top
JB20  [SJ']  101.6,104.14 180 top
JB21  [SJ']  120.02,102.87 180 top
JB22  [SJ']  137.8,102.23 180 top
JB23  [SJ']  159.39,105.41 180 top
JB24  [SJ']  186.69,107.95 180 top
JB25  [SJ']  75.56,83.19 180 top
JB26  [SJ']  100.96,83.19 180 top
JB27  [SJ']  123.19,85.73 180 top
JB28  [SJ']  138.43,83.19 180 top
JB29  [SJ']  156.84,82.55 270 top
JB30  [SJ']  176.53,83.19 180 top
JB31  [SJ']  77.47,69.22 180 top
JB32  [SJ']  102.87,67.31 180 top
JB33  [SJ']  118.74,64.14 180 top
JB34  [SJ']  141.61,67.31 180 top
JB35  [SJ']  156.84,64.14 180 top
JB36  [SJ']  180.34,67.31 180 top
JB37  [SJ']  68.58,40.64 180 top
JB38  [SJ']  100.96,45.72 180 top
JB39  [SJ']  120.65,46.99 180 top
JB40  [SJ']  137.8,46.35 180 top
JB41  [SJ']  161.93,48.89 90 top
JB42  [SJ']  183.52,48.26 180 top
JB43  [SJ']  79.38,29.85 90 top
JB44  [SJ']  100.96,29.85 90 top
JB45  [SJ']  125.09,29.85 90 top
JB46  [SJ']  160.02,26.67 180 top
JB47  [SJ']  213.36,120.97 270 top
JB48  [SJ']  240.35,128.59 90 top
JB49  [SJ']  264.48,121.92 0 top
JB50  [SJ']  271.46,123.83 180 top
JB51  [SJ']  298.13,121.29 270 top
JB52  [SJ']  322.9,124.46 0 top
JB53  [SJ']  216.22,93.98 270 top
JB54  [SJ']  232.41,94.62 270 top
JB55  [SJ']  259.4,100.33 0 top
JB56  [SJ']  277.5,97.79 0 top
JB57  [SJ']  282.26,95.25 180 top
JB58  [SJ']  301.31,97.16 180 top
JB59  [SJ']  329.25,95.25 180 top
JB60  [SJ']  216.22,74.93 270 top
JB61  [SJ']  233.36,75.57 270 top
JB62  [SJ']  244.16,75.88 270 top
JB63  [SJ']  277.18,78.74 0 top
JB64  [SJ']  282.26,78.11 180 top
JB65  [SJ']  301.31,78.11 180 top
JB66  [SJ']  328.3,75.25 180 top
JB67  [SJ']  320.36,40 180 top
JB67B1  [SJ']  338.45,78.11 180 top
JB68  [SJ']  216.22,55.88 270 top
JB69  [SJ']  240.35,62.86 0 top
JB70  [SJ']  254,56.2 180 top
JB71  [SJ']  277.18,59.69 0 top
JB72  [SJ']  282.26,57.78 270 top
JB73  [SJ']  301.31,59.69 180 top
JB74  [SJ']  346.71,59.69 0 top
JB74B  [SJ']  338.77,121.92 180 top
JB75  [SJ']  214,36.83 270 top
JB76  [SJ']  233.05,37.15 0 top
JB77  [SJ']  252.09,37.15 270 top
JB78  [SJ']  263.21,40 180 top
JB79  [SJ']  289.24,38.1 0 top
JB80  [SJ']  301.94,36.83 270 top
JB81  [SJ']  343.85,39.37 180 top
JB82  [SJ']  231.78,18.1 270 top
JB83  [SJ']  289.24,18.1 0 top
JB84  [SJ']  305.12,20.96 180 top
JB85  [SJ']  329.25,20.32 180 top
JB86  [SJ']  358.78,18.42 270 top
JB87  [SJ']  13.34,315.59 270 top
JB88  [SJ']  35.56,318.77 270 top
JB89  [SJ']  51.44,316.87 270 top
JB90  [SJ']  70.48,316.87 270 top
JB91  [SJ']  89.53,317.5 270 top
JB92  [SJ']  32.39,297.81 270 top
JB93  [SJ']  51.44,297.81 270 top
JB94  [SJ']  70.48,298.45 270 top
JB95  [SJ']  89.53,298.45 270 top
JB96  [SJ']  32.39,278.76 270 top
JB97  [SJ']  51.44,279.4 270 top
JB98  [SJ']  70.48,279.4 270 top
JB99  [SJ']  89.53,278.76 270 top
JB100  [SJ']  32.39,260.35 270 top
JB101  [SJ']  51.44,260.35 270 top
JB102  [SJ']  70.48,260.35 270 top
JB103  [SJ']  89.53,259.71 270 top
JB104  [SJ']  32.39,241.3 270 top
JB105  [SJ']  51.44,240.66 0 top
JB106  [SJ']  73.02,241.94 0 top
JB107  [SJ']  79.38,233.68 180 top
JB108  [SJ']  36.2,225.42 0 top
JB109  [SJ']  52.07,222.25 270 top
JB110  [SJ']  74.3,225.42 0 top
JB111  [SJ']  413.7,115.57 0 top
JB112  [SJ']  432.12,121.6 90 top
JB113  [SJ']  452.44,120.02 90 top
JB114  [SJ']  464.5,113.03 270 top
JB115  [SJ']  409.89,92.71 270 top
JB116  [SJ']  429.89,93.66 0 top
JB117  [SJ']  451.8,97.16 0 top
JB118  [SJ']  464.5,93.98 270 top
JB119  [SJ']  409.89,73.66 270 top
JB120  [SJ']  432.75,78.11 0 top
JB121  [SJ']  451.17,78.11 0 top
JB122  [SJ']  465.77,74.3 180 top
JB123  [SJ']  413.7,59.05 0 top
JB124  [SJ']  432.12,59.37 0 top
JB125  [SJ']  447.99,55.88 270 top
JB126  [SJ']  464.82,56.2 0 top
JB127  [SJ']  413.7,40 0 top
JB128  [SJ']  432.75,39.37 0 top
JB129  [SJ']  452.12,40.32 0 top
JB130  [SJ']  471.49,45.72 90 top
JB131  [SJ']  413.7,20.96 0 top
JB132  [SJ']  431.48,17.78 270 top
JB133  [SJ']  451.49,20.64 270 top
JB134  [SJ']  267.65,17.78 0 top
LED1  [LED5MM]  425.13,132.08 180 top
R1  1k  [R1206W'']  27.3,120.65 0 bottom
R2  1k  [R1206W'']  77.47,11.43 180 bottom
R3  1k  [R0805]  359.73,109.86 270 bottom
R4  10k  [R1206W'']  395.92,133.67 90 bottom
R5  10k  [R1206W'']  401,134.62 0 bottom
R6  10k  [R1206W'']  410.21,143.03 180 bottom
R7  [R1206W'']  461.33,135.57 0 bottom
R8  [R1206W'']  430.21,132.4 0 bottom
S1  Scroll Lock  [CHERRY-MX-LED]  26.04,126.37 0 top
S2  ESC  [CHERRY-MX-LED]  45.09,126.37 0 top
S3  Ins  [CHERRY-MX-LED]  26.04,107.32 0 top
S4  Pause  [CHERRY-MX@1]  45.09,107.32 0 top
S5  Home  [CHERRY-MX]  26.04,88.27 0 top
S6  P Up  [CHERRY-MX]  45.09,88.27 0 top
S7  End  [CHERRY-MX]  26.04,69.22 0 top
S8  P Dn  [CHERRY-MX]  45.09,69.22 0 top
S9  Up  [CHERRY-MX]  45.09,42.54 0 top
S10  Left  [CHERRY-MX]  26.04,23.5 0 top
S11  Down  [CHERRY-MX]  45.09,23.5 0 top
S12  Right  [CHERRY-MX]  64.13,23.5 0 top
S13  F1  [CHERRY-MX]  81.91,126.37 0 top
S14  F2  [CHERRY-MX]  100.96,126.37 0 top
S15  F3  [CHERRY-MX]  120.02,126.37 0 top
S16  F4  [CHERRY-MX]  139.06,126.37 0 top
S17  F5  [CHERRY-MX]  165.74,126.37 0 top
S18  F6  [CHERRY-MX]  184.78,126.37 0 top
S19  1  [CHERRY-MX]  89.53,99.7 0 top
S20  2  [CHERRY-MX]  108.58,99.7 0 top
S21  3  [CHERRY-MX]  127.64,99.7 0 top
S22  4  [CHERRY-MX]  146.69,99.7 0 top
S23  5  [CHERRY-MX]  165.74,99.7 0 top
S24  6  [CHERRY-MX]  184.78,99.7 0 top
S25  TAB  [CHERRY-MX]  84.45,80.65 0 top
S26  Q  [CHERRY-MX]  108.58,80.65 0 top
S27  W  [CHERRY-MX@1]  127.64,80.65 0 top
S28  E  [CHERRY-MX]  146.69,80.65 0 top
S29  R  [CHERRY-MX]  165.74,80.65 0 top
S30  T  [CHERRY-MX]  184.78,80.65 0 top
S31  LCtrl  [CHERRY-MX]  81.91,61.59 0 top
S32  A  [CHERRY-MX]  108.58,61.59 0 top
S33  S  [CHERRY-MX]  127.64,61.59 0 top
S34  D  [CHERRY-MX]  146.69,61.59 0 top
S35  F  [CHERRY-MX]  165.74,61.59 0 top
S36  G  [CHERRY-MX]  184.78,61.59 0 top
S37  L Shift  [CHERRY-MX]  77.47,42.54 0 top
S37B  L Shift  [CHERRY-MX]  81.91,42.54 180 top
S37B1  L Shift  [CHERRY-MX]  84.45,42.54 180 top
S38  Z  [CHERRY-MX]  108.58,42.54 0 top
S39  X  [CHERRY-MX]  127.64,42.54 0 top
S40  C  [CHERRY-MX]  146.69,42.54 0 top
S41  V  [CHERRY-MX]  165.74,42.54 0 top
S42  B  [CHERRY-MX]  184.78,42.54 0 top
S43  Caps Lock  [CHERRY-MX-LED]  83.18,23.5 0 top
S44  Alt  [CHERRY-MX]  104.77,23.5 0 top
S45  Menu(Win)  [CHERRY-MX]  128.91,23.5 0 top
S46  Space  [CHERRY-MX]  167.64,23.5 0 top
S47  F7  [CHERRY-MX-4P]  212.41,127 180 top
S48  F8  [CHERRY-MX-4P]  231.46,127 180 top
S49  F9  [CHERRY-MX-4P]  258.13,127 180 top
S50  F10  [CHERRY-MX-4P]  277.18,127 180 top
S51  F11  [CHERRY-MX-4P]  296.23,127 180 top
S52  F12  [CHERRY-MX-4P]  315.28,127 180 top
S53  7  [CHERRY-MX-4P]  212.41,100.33 180 top
S54  8  [CHERRY-MX-4P]  231.46,100.33 180 top
S55  9  [CHERRY-MX-4P]  250.51,100.33 180 top
S56  0  [CHERRY-MX-4P]  269.56,100.33 180 top
S57  -  [CHERRY-MX-4P]  288.61,100.33 180 top
S58  =  [CHERRY-MX-4P]  307.66,100.33 180 top
S59  BS  [CHERRY-MX-4P]  336.23,100.33 180 top
S60  Y  [CHERRY-MX-4P]  212.41,81.28 180 top
S61  U  [CHERRY-MX-4P]  231.46,81.28 180 top
S62  I  [CHERRY-MX-4P]  250.51,81.28 180 top
S63  O  [CHERRY-MX-4P]  269.56,81.28 180 top
S64  P  [CHERRY-MX-4P]  288.61,81.28 180 top
S65  [  [CHERRY-MX-4P]  307.66,81.28 180 top
S66  ]  [CHERRY-MX-4P]  326.71,81.28 180 top
S67  |d  [CHERRY-MX-4P]  326.71,43.18 180 top
S67B  |u  [CHERRY-MX]  345.76,81.28 180 top
S67C  |  [CHERRY-MX-4P]  350.84,81.28 180 top
S67C1  FN2  [CHERRY-MX-4P]  265.75,24.13 180 top
S68  H  [CHERRY-MX-4P]  212.41,62.23 180 top
S69  J  [CHERRY-MX-4P]  231.46,62.23 180 top
S70  K  [CHERRY-MX-4P]  250.51,62.23 180 top
S71  L  [CHERRY-MX-4P]  269.56,62.23 180 top
S72  :  [CHERRY-MX-4P]  288.61,62.23 180 top
S73  "  [CHERRY-MX-4P]  307.66,62.23 180 top
S74  Del  [CHERRY-MX-4P]  345.76,127 180 top
S74A  Enter  [CHERRY-MX-4P]  338.77,62.23 180 top
S74B  Enter  [CHERRY-MX]  336.23,62.23 180 top
S75  N  [CHERRY-MX-4P]  212.41,43.18 180 top
S76  M  [CHERRY-MX-4P]  231.46,43.18 180 top
S77  <  [CHERRY-MX-4P]  250.51,43.18 180 top
S78  >  [CHERRY-MX-4P]  269.56,43.18 180 top
S79  ~  [CHERRY-MX-4P]  288.61,43.18 180 top
S80  ?  [CHERRY-MX-4P]  307.66,43.18 180 top
S81  R Shift  [CHERRY-MX-4P]  350.84,43.18 180 top
S82  Space  [CHERRY-MX-4P]  229.55,24.13 180 top
S83  FN3  [CHERRY-MX-4P]  287.34,24.13 180 top
S84  R_Alt  [CHERRY-MX-4P]  311.47,24.13 180 top
S85  RCtrl  [CHERRY-MX-4P]  335.6,24.13 180 top
S86  PrtScr  [CHERRY-MX-4P]  357.19,24.13 180 top
S87  Num  [CHERRY-MX-4P]  9.53,323.21 180 top
S88  D  [CHERRY-MX-4P]  28.57,323.21 180 top
S89  E  [CHERRY-MX-4P]  47.62,323.21 180 top
S90  F  [CHERRY-MX-4P]  66.67,323.21 180 top
S91  /  [CHERRY-MX-4P]  85.72,323.21 180 top
S92  A  [CHERRY-MX-4P]  28.57,304.16 180 top
S93  B  [CHERRY-MX-4P]  47.62,304.16 180 top
S94  C  [CHERRY-MX-4P]  66.67,304.16 180 top
S95  *  [CHERRY-MX-4P]  85.72,304.16 180 top
S96  7  [CHERRY-MX-4P]  28.57,285.12 180 top
S97  8  [CHERRY-MX-4P]  47.62,285.12 180 top
S98  9  [CHERRY-MX-4P]  66.67,285.12 180 top
S99  -  [CHERRY-MX-4P]  85.72,285.12 180 top
S100  4  [CHERRY-MX-4P]  28.57,266.06 180 top
S101  5  [CHERRY-MX-4P]  47.62,266.06 180 top
S102  6  [CHERRY-MX-4P]  66.67,266.06 180 top
S103  +  [CHERRY-MX-4P]  85.72,266.06 180 top
S104  1  [CHERRY-MX-4P]  28.57,247.01 180 top
S105  2  [CHERRY-MX-4P]  47.62,247.01 180 top
S106  3  [CHERRY-MX-4P]  66.67,247.01 180 top
S107  NumEnter  [CHERRY-MX-4P]  86.36,246.38 180 top
S107B  NumEnter  [CHERRY-MX]  85.72,237.49 90 top
S107B1  NumEnter  [CHERRY-MX-4P]  463.23,33.02 90 top
S108  0  [CHERRY-MX-4P]  28.57,227.97 180 top
S109  00  [CHERRY-MX-4P]  47.62,227.97 180 top
S110  .  [CHERRY-MX-4P]  66.67,227.97 180 top
S111  D  [CHERRY-MX-4P]  406.08,118.75 180 top
S112  E  [CHERRY-MX-4P]  425.13,118.75 180 top
S113  F  [CHERRY-MX-4P]  444.18,118.75 180 top
S114  /  [CHERRY-MX-4P]  463.23,118.75 180 top
S115  A  [CHERRY-MX-4P]  406.08,99.7 180 top
S116  B  [CHERRY-MX-4P]  425.13,99.7 180 top
S117  C  [CHERRY-MX-4P]  444.18,99.7 180 top
S118  *  [CHERRY-MX-4P]  463.23,99.7 180 top
S119  7  [CHERRY-MX-4P]  406.08,80.65 180 top
S120  8  [CHERRY-MX-4P]  425.13,80.65 180 top
S121  9  [CHERRY-MX-4P]  444.18,80.65 180 top
S122  -  [CHERRY-MX-4P]  463.23,80.65 180 top
S123  4  [CHERRY-MX-4P]  406.08,61.59 180 top
S124  5  [CHERRY-MX-4P]  425.13,61.59 180 top
S125  6  [CHERRY-MX-4P]  444.18,61.59 180 top
S126  +  [CHERRY-MX-4P]  463.23,61.59 180 top
S127  1  [CHERRY-MX-4P]  406.08,42.54 180 top
S128  2  [CHERRY-MX-4P]  425.13,42.54 180 top
S129  3  [CHERRY-MX-4P]  444.18,42.54 180 top
S130  NumEnter  [CHERRY-MX-4P]  463.23,42.54 180 top
S131  0  [CHERRY-MX-4P]  406.08,23.5 180 top
S132  00  [CHERRY-MX-4P]  425.13,23.5 180 top
S133  .  [CHERRY-MX-4P]  444.18,23.5 180 top
S134  NumLock  [B3F-31XX]  421.32,137.48 180 top
SV1  [FE09]  438.79,141.92 0 top
SV2  [FE06]  42.55,339.72 0 top  (outside the outline)
SV3  [FE07]  24.76,339.72 0 top  (outside the outline)
SV4  CON_KB_B  [FE12]  222.25,112.71 0 top
U$1  [18X18]  26.04,126.37 0 top
U$2  [18X18]  45.09,126.37 0 top
U$3  [18X18]  26.04,107.32 0 top
U$4  [18X18]  26.04,88.27 0 top
U$5  [18X18]  45.09,107.32 0 top
U$6  [18X18]  26.04,69.22 0 top
U$7  [18X18]  45.09,88.27 0 top
U$8  [18X18]  45.09,69.22 0 top
U$9  [18X18]  62.87,24.77 0 top
U$10  [18X18]  43.82,22.23 90 top
U$11  [18X18]  45.09,42.54 90 top
U$12  [18X18]  127.64,42.54 90 top
U$13  [18X18]  24.76,22.23 90 top
U$14  [18X18]  81.91,22.23 90 top
U$15  [18X23]  104.77,23.5 0 top
U$16  [18X23]  128.91,23.5 0 top
U$17  [18X52]  167.64,23.5 0 top
U$18  [18X18]  108.58,42.54 0 top
U$19  [18X18]  184.78,42.54 0 top
U$20  [18X18]  165.74,42.54 0 top
U$21  [18X18]  146.69,42.54 0 top
U$22  [18X42]  77.47,42.54 0 top
U$23  [18X18]  127.64,61.59 90 top
U$24  [18X18]  108.58,61.59 0 top
U$25  [18X18]  184.78,61.59 0 top
U$26  [18X18]  165.74,61.59 0 top
U$27  [18X18]  146.69,61.59 0 top
U$28  [18X33]  81.91,61.59 0 top
U$29  [18X18]  127.64,80.65 90 top
U$30  [18X18]  108.58,80.65 0 top
U$31  [18X18]  184.78,80.65 0 top
U$32  [18X18]  165.74,80.65 0 top
U$33  [18X18]  146.69,80.65 0 top
U$34  [18X28]  84.45,80.65 0 top
U$35  [18X18]  127.64,99.7 90 top
U$36  [18X18]  108.58,99.7 0 top
U$37  [18X18]  184.78,99.7 0 top
U$38  [18X18]  165.74,99.7 0 top
U$39  [18X18]  146.69,99.7 0 top
U$40  [18X18]  89.53,99.7 0 top
U$41  [18X18]  184.78,126.37 0 top
U$42  [18X18]  165.74,126.37 0 top
U$43  [18X18]  120.02,126.37 0 top
U$44  [18X18]  139.06,126.37 0 top
U$45  [18X18]  100.96,126.37 0 top
U$46  [18X18]  81.91,126.37 0 top
U$47  [18X18]  211.14,128.27 0 top
U$48  [18X18]  230.19,128.27 0 top
U$49  [18X18]  294.96,128.27 0 top
U$50  [18X18]  256.86,128.27 0 top
U$51  [18X18]  275.91,128.27 0 top
U$52  [18X18]  314.01,128.27 0 top
U$53  [18X18]  211.14,101.6 0 top
U$54  [18X18]  230.19,101.6 0 top
U$55  [18X18]  249.24,101.6 0 top
U$56  [18X18]  268.29,101.6 0 top
U$57  [18X18]  287.34,101.6 0 top
U$58  [18X18]  306.39,101.6 0 top
U$59  [18X18]  211.14,82.55 0 top
U$60  [18X18]  230.19,82.55 0 top
U$61  [18X18]  249.24,82.55 0 top
U$62  [18X18]  268.29,82.55 0 top
U$63  [18X18]  287.34,82.55 0 top
U$64  [18X18]  306.39,82.55 0 top
U$65  [18X18]  325.44,82.55 0 top
U$66  [18X18]  344.49,82.55 0 top
U$67  [18X18]  211.14,63.5 0 top
U$68  [18X18]  230.19,63.5 0 top
U$69  [18X18]  249.24,63.5 0 top
U$70  [18X18]  268.29,63.5 0 top
U$71  [18X18]  287.34,63.5 0 top
U$72  [18X18]  306.39,63.5 0 top
U$73  [18X18]  211.14,44.45 0 top
U$74  [18X18]  230.19,44.45 0 top
U$75  [18X18]  249.24,44.45 0 top
U$76  [18X18]  268.29,44.45 0 top
U$77  [18X18]  287.34,44.45 0 top
U$78  [18X18]  306.39,44.45 0 top
U$79  [18X52]  229.55,24.13 0 top
U$80  [18X37]  336.23,100.33 0 top
U$81  [18X18]  404.81,120.02 0 top
U$82  [18X18]  423.86,120.02 0 top
U$83  [18X18]  355.92,25.4 0 top
U$84  [18X23]  335.6,24.13 0 top
U$85  [18X23]  311.47,24.13 0 top
U$86  [18X23]  287.34,24.13 0 top
U$87  [18X18]  8.26,324.49 0 top
U$88  [18X18]  27.3,324.49 0 top
U$89  [18X18]  46.36,324.49 0 top
U$90  [18X18]  65.41,323.85 0 top
U$91  [18X18]  84.45,324.49 0 top
U$92  [18X18]  84.45,305.44 0 top
U$93  [18X18]  65.41,305.44 0 top
U$94  [18X18]  46.36,305.44 0 top
U$95  [18X18]  27.3,305.44 0 top
U$96  [18X18]  27.3,286.38 0 top
U$97  [18X18]  46.36,286.38 0 top
U$98  [18X18]  65.41,286.38 0 top
U$99  [18X18]  84.45,286.38 0 top
U$100  [18X18]  27.3,267.33 0 top
U$101  [18X18]  46.36,267.33 0 top
U$102  [18X18]  65.41,267.33 0 top
U$103  [18X18]  84.45,267.33 0 top
U$104  [18X18]  27.3,248.28 0 top
U$105  [18X18]  46.36,248.28 0 top
U$106  [18X18]  65.41,248.28 0 top
U$107  [18X18]  84.45,248.28 0 top
U$108  [18X18]  27.3,229.23 0 top
U$109  [18X18]  46.36,229.23 0 top
U$110  [18X18]  65.41,229.23 0 top
U$111  [37X18]  85.72,237.49 0 top
U$112  [18X37]  336.23,62.23 0 top
U$114  [18X33]  81.91,42.54 0 top
U$115  [18X28]  84.45,42.54 0 top
U$116  [18X18]  344.49,128.27 0 top
U$117  [18X18]  325.44,44.45 0 top
U$118  [18X18]  378.78,-3.81 0 top  (outside the outline)
U$119  [18X18]  442.91,120.02 0 top
U$120  [18X18]  461.96,120.02 0 top
U$121  [18X18]  461.96,100.97 0 top
U$122  [18X18]  442.91,100.97 0 top
U$123  [18X18]  423.86,100.97 0 top
U$124  [18X18]  404.81,100.97 0 top
U$125  [18X18]  404.81,81.92 0 top
U$126  [18X18]  423.86,81.92 0 top
U$127  [18X18]  442.91,81.92 0 top
U$128  [18X18]  461.96,81.92 0 top
U$129  [18X18]  404.81,62.86 0 top
U$130  [18X18]  423.86,62.86 0 top
U$131  [18X18]  442.91,62.86 0 top
U$132  [18X18]  461.96,62.86 0 top
U$133  [18X18]  404.81,43.81 0 top
U$134  [18X18]  423.86,43.81 0 top
U$135  [18X18]  442.91,43.81 0 top
U$136  [18X18]  461.96,43.81 0 top
U$137  [18X18]  404.81,24.77 0 top
U$138  [18X18]  423.86,24.77 0 top
U$139  [18X18]  442.91,24.77 0 top
U$140  [37X18]  463.23,33.02 0 top
U$141  [18X18]  461.96,24.77 0 top
U$142  [KEY]  446.72,42.54 0 top
U$143  [KEY]  446.72,23.5 0 top
U$144  [KEY]  427.67,42.54 0 top
U$145  [KEY]  427.67,23.5 0 top
U$146  [KEY]  408.62,23.5 0 top
U$147  [KEY]  408.62,42.54 0 top
U$148  [KEY]  446.72,61.59 0 top
U$149  [NUMENTER]  465.77,33.02 0 top
U$150  [KEY]  427.67,61.59 0 top
U$151  [KEY]  408.62,61.59 0 top
U$152  [KEY]  465.77,61.59 0 top
U$153  [KEY]  465.77,80.65 0 top
U$154  [KEY]  446.72,80.65 0 top
U$155  [KEY]  427.67,80.65 0 top
U$156  [KEY]  408.62,80.65 0 top
U$157  [KEY]  408.62,99.7 0 top
U$158  [KEY]  427.67,99.7 0 top
U$159  [KEY]  446.72,99.7 0 top
U$160  [KEY]  465.77,99.7 0 top
U$161  [KEY]  465.77,118.75 0 top
U$162  [KEY]  446.72,118.75 0 top
U$163  [KEY]  427.67,118.75 0 top
U$164  [KEY]  408.62,118.75 0 top
U$213  [18X42]  338.77,62.23 0 top
U$214  [18X28]  386.4,106.68 0 top
U$215  [18X18]  264.48,25.4 0 top
U$216  [18X28]  350.84,43.18 0 top
U$217  [18X28]  350.84,81.28 0 top

## Tracks (layer width: path | path; a pad name or v marks a point on that pad's centre or on a via)
1
  Bottom 0.406: D56.C 274.95,107.95 273.05,108.59 273.05,113.03 273.37,113.35 273.37,115.25 273.69,115.57 273.69,119.06 | 280.99,135.25 283.85,133.35 289.24,133.35 292.42,135.25 | 273.25,135.25 271.78,134.62 D50.C | 300.36,135.25 302.89,133.35 308.61,133.35 311.58,135.69 | 341.95,135.57 339.09,133.35
  Bottom 0.61: 311.58,135.69 320.99,135.69 D52.C 330.52,130.6 D64B.C 339.09,130.29 339.09,133.35 | 273.69,119.06 267.65,122.24 | J57.1 352.83,134.62 351.88,135.57 341.95,135.57 | 273.25,135.25 280.99,135.25 | 292.42,135.25 300.36,135.25
  Bottom 0.813: D50.C 267.65,131.56 D49.C
  Bottom 1.016: 267.65,122.24 267.65,131.56
2
  Bottom 0.61: J24.2 D58.C | 312.1,117.36 312.1,108.9 | J18.2 312.42,118.75 312.1,118.43
  Bottom 0.813: 312.1,117.36 312.1,118.43 307.66,122.87 303.53,122.87 302.26,121.6 D51.C
  Bottom 1.016: D58.C 302.58,108.9 312.1,108.9 312.74,108.9 315.17,105.52 D59.C
2I
  Bottom 0.406: 280.88,140.13 285.12,136.21 288.29,136.21 292.42,139.81 | 273.25,140.13 268.92,136.21 266.06,136.21 262.05,140.13 | 300.36,140.02 304.17,136.21 307.02,136.21 311.36,140.13 | 337.5,135.25 341.95,138.75
  Bottom 0.61: 2D1.14 365.76,116.2 367.67,118.11 367.67,126.05 356.24,134.3 356.24,136.21 353.69,138.75 341.95,138.75 | D48.C 243.32,135.05 244.16,135.89 248.17,135.89 252.41,140.13 262.05,140.13 | 280.88,140.13 273.25,140.13 | 311.36,140.13 326.6,140.13 328.93,136.84 328.93,136.52 | 292.42,139.81 293.26,140.02 300.36,140.02 | 328.93,136.52 J66.1 | 337.5,135.25 333.06,135.25 331.79,136.52 328.93,136.52
2J
  Bottom 0.61: D55.C 264.68,92.39 269.24,92.39 271.46,94.62 278.45,94.62 280.35,97.16 280.35,100.01 282.57,104.46 282.57,107 284.16,108.9 293.05,108.9 294.64,106.68 J24.1
3
  Bottom 0.61: D57.C 286.07,89.54 283.1,89.54 D63.C 278.65,86.16 274.64,90.17 265.11,90.17 261.62,85.09 257.81,85.09 255.38,89.74 245.95,89.74 242.57,86.36 240.03,86.36 237.17,89.22 237.17,89.85 | 237.17,89.85 237.17,90.81 237.92,92.51 D54.C | D47.C 224.9,87.43 227.33,89.85 237.17,89.85
  Bottom 1.016: D57.C J19.2
3A1  (2 unrouted)
  Bottom 0.406: JA96.2 JA97.2 JA98.2 | SV2.1 36.2,324.36 JA89.2
3A2  (1 unrouted)
  Bottom 0.406: JA100.2 JA101.2 JA102.2
3A3  (1 unrouted)
  Bottom 0.406: JA107.2 77.22,238 JA106.2 JA105.2 21.72,238 20.32,239.39 20.32,241.3 | 20.32,241.3 20.32,294.64 | 20.32,294.64 26.04,294.64 JA92.2 | 20.32,241.3 JA104.2 | 20.32,294.64 20.32,311.15 23.62,314.2 JA88.2 27.43,313.56 28.57,312.42 53.98,312.42 55.25,313.69 64.01,313.69 JA90.2
3A4
  Bottom 0.406: JA110.2 JA108.2 22.99,218.95 20.32,221.61 20.32,235.58 17.14,238.76 17.14,288.93 15.24,290.83 15.24,309.88 14.61,310.51 11.43,310.51 10.16,311.78 10.16,321.31 14.61,325.75 15.24,325.75 15.88,326.39 15.88,334.64 12.7,337.82 12.7,341 15.24,343.53 41.91,343.53 43.82,341.63 SV2.4
3A5
  Bottom 0.406: JA87.2 3.17,320.68 1.91,321.94 1.91,332.11 13.97,344.81 43.18,344.81 46.36,341.63 SV2.5 46.36,338.45 53.34,331.47 75.56,331.47 78.61,328.42 JA91.2 JA95.2 76.2,299.08 73.02,295.91 JA94.2
3A6  (2 unrouted)
3B0
  Bottom 0.406: D92.C 18.62,336.34 17.14,337.82 SV3.1
3B2
  Bottom 0.406: SV3.2 19.68,337.19 20.32,336.55 20.32,322.58 21.59,321.31 27.3,321.31 30.05,318.56 D88.C 30.05,316.02 31.11,314.96 34.93,314.96 | D89.C 35.56,315.59 34.93,314.96 | D94.C 55.04,315.39 53.34,313.69 36.2,313.69 34.93,314.96
3B3  (2 unrouted)
3B7  (1 unrouted)
  Bottom 0.406: D107.C 76.2,249.55 75.13,250.62 D103.C
3B8  (1 unrouted)
  Bottom 0.406: 76.63,295.5 D98.C 77.04,278.36 D99.C 76.63,275.81 D102.C 76.83,259.51 76.83,253.36 77.79,252.41 | 76.63,295.5 D95.C | D106.C 77.9,252.3 77.79,252.41 | D110.C 95.25,252.09 92.07,255.27 81.28,255.27 77.79,252.41 | 76.63,295.5 77.24,295.5 78.74,294 90.8,294 93.98,297.18 93.98,329.56 90.8,332.74 61.59,332.74 55.88,338.45
3B9  (3 unrouted)
  Bottom 0.406: D101.C D105.C 57.36,244.27 58.42,243.2 58.42,240.03 57.15,238.76 49.53,238.76 48.26,240.03 48.26,242.57 46.36,244.47 40.64,244.47 38.1,241.94 D108.C
3B10
  Bottom 0.406: D104.C 21.38,236.42 18.62,239.19 D100.C D96.C 18.62,290.19 16.51,292.1 16.51,309.88 16.3,311.15 D87.C 16.3,321.11 17.14,321.94 17.14,335.28 14.61,338.45 14.61,341 15.88,342.26 31.11,342.26 32.39,341 SV3.7
3J
  Bottom 0.61: J20.1 315.51,94.62 319.09,94.62 322.9,90.81 330.52,90.81 334.01,86.38 334.01,84.89 | J59.1 351.88,96.29 348.93,92.39 343.85,92.39 338.45,86.04 D67B.C 334.01,84.89 | D66.C 334.01,77.99 334.01,84.89
4
  Bottom 0.61: D74.C 314.85,67.74 311.47,71.12 311.26,71.33 311.26,71.44 311.26,74.64 J62.1
  Bottom 0.813: 301.94,69.62 303.12,70.8 310.2,70.8 311.47,71.12 | D65.C 311.26,71.44
  Bottom 1.016: J21.1 301.94,69.62
4J
  Bottom 0.61: J21.2 295.36,68.17 291.15,72.39 D64.C 288.4,70.48 283.53,70.48 280.35,67.31 D71.C 278.02,67.11 272.1,73.03 264.48,73.03 261.94,75.57 258.76,75.57 257.49,74.3 J25.2
4J2
  Bottom 0.61: J25.1 250.91,73.03 247.97,73.03 242.89,67.95 238.87,67.95 D61.C 235.7,71.55 234.63,70.48 230.19,70.48 225.86,74.82 D53.C
5  (1 unrouted)
  Bottom 0.61: D67.C 314.85,48.69 312.1,51.43 309.88,51.43 | 309.88,51.43 303.53,51.43 302.89,52.07 | J60.1 309.97,51.52 309.88,51.43
  Bottom 1.016: J22.1 299.16,47.85 302.89,52.07 D73.C
5J  (1 unrouted)
  Bottom 0.61: J22.2 296.16,48.44 293.17,51.43 283.53,51.43 | 283.53,51.43 280.99,48.89 278.13,48.89 273.37,53.98 264.16,53.98 261.3,57.15 258.76,57.15 | 283.53,51.43 D72.C | D62.C 253.3,70.87 255.59,69.85 258.44,66.36 258.76,66.04 258.76,57.15 | 258.76,57.15 255.59,53.66 245.75,53.66 245.11,54.29 243,56.09 D69.C 239.6,56.72 236.86,53.98 D60.C
6
  Bottom 0.61: J65.1 318.86,29.12 314.85,33.77 D81.C | D79.C 282.78,32.59 J26.2
  Bottom 1.016: D81.C D80.C 311.9,34.09 310.83,33.02 305.44,33.02 300.04,29.21 296.23,29.21 292.85,32.59 D79.C
6J2
  Bottom 0.61: J26.1 277.5,42.77 277.5,47.62 273.48,51.96 265,51.96 262.25,49.21 260.35,49.21 | 260.35,49.21 258.13,49.21 255.18,51.84 D70.C | 260.35,49.21 260.35,33.34 257.49,30.48 252.96,30.48 J27.2
6J3
  Bottom 0.61: J27.1 242.98,37.46 239.4,37.46 237.49,35.56 235.9,35.56 D68.C
7
  Bottom 0.61: J23.1 275.5,23.9 283.96,15.45 290.08,15.45 294.32,17.46 296.34,17.46 D84.C 300.04,17.99 306.59,13.97 316.34,13.97 321.63,19.26 D85.C 325.44,19.37 330.2,15.24 341.63,15.24 343.22,17.15 347.03,17.15 350.52,13.97 365.44,13.97 367.67,16.19 367.67,25.08 366.71,26.04 366.71,29.85 365.12,33.02 365.44,59.05 365.44,93.98 368.3,96.52 368.3,109.54 366.39,111.44 365.76,112.71 364.81,113.67 2D1.13
7J
  Bottom 0.61: J23.2 272.5,30.71 269.56,33.66 263.41,33.66 D78.C 262.57,33.66 257.81,28.89 238.76,28.89 236.54,31.12 D76.C 235.7,33.02 227.33,33.02 223.09,37.26 D75.C
8
  Bottom 0.61: 2D1.12 365.12,111.12 367.03,109.22 367.03,99.06 363.86,95.89 363.86,64.77 363.54,59.37 364.17,54.61 364.17,51.75 362.9,45.4 362.9,32.7 364.17,30.16 364.17,26.04 365.12,25.08 365.12,21.7 D86.C 364.6,15.99 364.17,15.56 352.43,15.56 349.02,18.64 J58.2
8J
  Bottom 0.61: 272.1,14.92 274,16.4 D137.C 282.69,13.65 292.21,13.65 D83.C 299.51,15.88 300.99,15.24 306.07,12.06 316.87,12.06 320.68,15.88 325.75,15.88 329.25,12.38 342.18,12.38 J58.1
  Bottom 1.016: 272.1,14.92 261.3,14.92 256.95,18.11 | 256.95,18.11 256.54,18.42 252.41,15.56 241.3,15.56 | 241.19,15.56 241.3,15.56 | D82.C 241.3,15.56 | D77.C 255.06,26.88 256.54,25.4 256.54,18.53 256.95,18.11
+3VD
  Top 0.61: C4.1 2D2.14 D138.C
+5V  (1 unrouted)
  Top 0.61: D139.A SV4.11 233.68,115.57 232.41,115.57 232.41,120.65 245.11,120.65 245.11,136.21 363.86,136.21 2D1.16
  Bottom 0.406: SV1.9 461.64,145.1 470.69,145.1
  Bottom 0.61: C1.1 453.74,131.95 458.31,133.19 460.69,133.67 462.6,134.3 R7.1 470.85,137.16 | 418.78,143.51 417.83,142.88 414.09,142.88 R6.2 | 429.26,146.05 433.07,144.14 436.88,144.14 439.1,145.73 | R3.1 360.68,111.76 360.68,119.38 361.31,120.33 C3.1 2D1.16
  Bottom 0.813: R6.2 411.71,144.55 410.21,146.05 403.23,146.05 401.95,144.78 | R4.2 394.74,135.17 393.7,136.21 393.7,141.6 397.51,144.78 401.95,144.78 | D136.A 401.95,144.78
  Bottom 1.016: SV1.9 447.99,145.73 439.1,145.73 | 429.26,146.05 421.96,146.05 418.78,143.51 | 470.85,137.16 3D1.16 473.07,136.69 473.07,142.88 470.69,145.1 | R5.2 R4.2
+5V_K1  (2 unrouted)
A1  (2 unrouted)
  Bottom 1.016: JA26.2 JA28.2 JA29.2
A2  (3 unrouted)
  Bottom 1.016: JA25.2 92.07,85.73 92.07,50.16 89.53,47.62 | 89.53,47.62 89.53,28.7 JA43.2 89.66,26.54 90.8,25.4 90.8,21.59 95.25,17.15 132.72,17.15 137.16,21.59 JA45.2 | 89.53,47.62 JA37.2 | JA30.2 187.33,101.6 190.5,103.51 190.5,113.03 187.33,116.2 187.33,127.64 180.98,133.98 147.96,133.98 141.61,127.64 141.61,124.46 139.7,122.56 132.08,122.56 129.54,125.09 129.54,126.37 127.64,128.27 JA15.2
A3  (1 unrouted)
  Bottom 1.016: JA32.2 JA33.2 130.18,70.61 | 130.18,70.61 JA34.2 JA35.2 | JA27.2 130.18,70.61
A4  (3 unrouted)
  Bottom 1.016: JA16.2 JA18.2 187.33,135.89 189.23,135.89 193.04,132.08 193.04,71.25 | JA36.2 193.04,71.25 | JA44.2 118.74,28.58 118.74,33.02 118.87,33.15 JA46.2 173.99,33.15 173.99,46.99 179.07,52.07 193.04,52.07 193.04,71.12 193.04,71.25
A5  (1 unrouted)
  Bottom 1.016: JA38.2 JA39.2 JA40.2 JA41.2
A6  (2 unrouted)
  Bottom 1.016: JA12.2 JA11.2 JA10.2
A7  (via drill 0.8 pad 2.3)  (2 unrouted)
  Top 1.016: v154.94,113.03 v149.86,113.03
  Bottom 1.016: JA5.2 33.66,97.92 | 33.66,97.92 JA6.2 | JA3.2 33.66,112.4 33.66,97.92 | JA13.2 JA14.2 106.55,136.02 110.49,132.08 110.49,123.19 115.57,123.19 115.57,118.11 | 115.57,118.11 1S3.7 | D24.A 176.61,109.98 JA23.2 166.88,109.98 165.74,111.12 159.39,111.12 156.84,113.03 v154.94,113.03 | v149.86,113.03 144.15,118.11 115.57,118.11
A8  (1 unrouted)
  Bottom 1.016: JA7.2 JA8.2 52.71,78.87 | 52.71,78.87 52.71,78.74 | 52.71,78.87 52.71,103.51 JA4.2 | 120.02,107.44 JA20.2 JA19.2 | 120.02,107.44 JA21.2 JA22.2 152.4,116.84 156.84,116.84 JA17.2 | 1S3.8 118.11,113.67 118.74,112.4 120.02,110.49 120.02,107.44
B0
  Bottom 1.016: D38.C D32.C D26.C 93.98,88.27 D25.C 72.39,88.9 54.61,106.68 1S1.1 D2.C
B1  (3 unrouted)
  Top 0.406: HL2.4 47.04,104.82 47.62,105.41 47.62,109.22 50.16,111.76 50.16,113.67 47.62,116.2 47.62,117.57 HL1.4
  Bottom 1.016: D13.C 57.15,128.91 1S1.2 57.15,108.59 75.56,90.17 96.52,90.17 96.52,80.65 98.42,78.74 | D39.C 114.3,40 104.77,30.48 104.77,26.67 105.41,26.04 107.31,26.04 107.95,25.4 107.95,22.23 104.77,19.05 96.52,19.05 93.34,22.23 93.34,32.18 D43.C
B2  (2 unrouted)
  Bottom 1.016: D28.C D34.C 135.25,65.84 D40.C | 1S1.3 59.69,138.22 93.34,138.22 | D14.C 93.34,138.22 | D16.C D15.C 111.76,138.22 93.34,138.22
B3
  Bottom 1.016: D42.C 174.86,57.05 | 174.86,57.05 174.62,57.15 D36.C D30.C 173.36,75.77 | D29.C 173.36,75.77 | 173.36,75.77 173.36,92.71 157.69,92.71 D23.C 156.64,92.08 77.47,92.08 62.23,107.32 1S1.4 | D41.C 159.18,54.2 D35.C 159.28,57.05 174.86,57.05
B4
  Bottom 1.016: 73.02,100.97 79.38,94.62 172.09,94.62 175.77,98.3 JA24.2 | 73.02,100.97 64.77,109.22 1S1.5 | D19.C 74.3,102.23 73.02,100.97
B5
  Bottom 0.406: 153.03,96.52 99.06,96.52
  Bottom 1.016: 153.03,96.52 154.94,98.43 154.94,106.05 158.32,109.43 D18.C | D20.C 99.06,96.52 81.28,96.52 76.83,100.97 76.83,103.51 75.56,104.78 73.02,104.78 67.31,110.49 1S1.6
B6  (2 unrouted)
  Bottom 1.016: D21.C 118.11,73.03 109.22,73.03 107.31,71.12 107.31,66.68 111.12,62.86 111.12,55.24 107.95,52.07 107.95,46.35 111.12,44.45 114.93,45.72 117.47,45.09 117.47,35.56 118.31,34.72
B7  (1 unrouted)
  Bottom 1.016: D10.C 30.68,39.37 D9.C 28.57,47.2 28.57,70.48 25.4,73.66 25.4,80.01 24.33,81.08 D7.C 18.41,84.89 18.41,97.79 20.32,100.33 21.38,100.33 D5.C
B8  (1 unrouted)
  Bottom 1.016: D6.C D8.C
B9  (1 unrouted)
  Bottom 1.016: D3.C 16.51,58.42 D12.C
B10  (via drill 0.8 pad 2.3)
  Top 1.016: v76.83,108.59 v59.05,95.25
  Bottom 1.016: D11.C 37.47,15.24 74.3,15.24 | 74.3,15.24 78.1,15.24 78.74,14.61 138.43,14.61 140.34,16.51 157.28,16.51 D46.C | 1S2.1 80.01,111.76 v76.83,108.59 | v59.05,95.25 59.05,38.1 64.77,38.1 74.3,28.58 74.3,15.24
B11  (via drill 0.8 pad 2.3)
  Top 1.016: v62.87,92.71 v78.74,105.41
  Bottom 1.016: D37.C 63.07,92.92 v62.87,92.71 | v78.74,105.41 82.55,109.22 1S2.2
B13
  Bottom 1.016: D22.C 89.1,109.02 87.63,110.49 1S2.4
B14  (via drill 0.8 pad 2.3)  (1 unrouted)
  Top 1.016: v99.06,88.9 v99.06,111.12
  Bottom 1.016: D1.C D4.C | D27.C 116.41,83.82 | 116.41,83.82 116.41,77.68 114.3,75.57 102.23,75.57 96.52,71.12 96.52,65.41 97.79,63.5 97.79,54.61 96.52,52.7 D44.C | v99.06,88.9 103.5,88.9 110.49,82.55 111.76,82.55 114.3,83.82 116.41,83.82 | v99.06,111.12 90.17,111.12 1S2.5
B15  (1 unrouted)
  Bottom 1.016: D17.C 95.88,120.65 92.71,118.11 1S2.6
B16  (1 unrouted)
COLN1